# Altium schematic sheet assemblies.SchDoc
size A4; DocumentNumber: 2; SheetNumber: 2; SheetTotal: 7
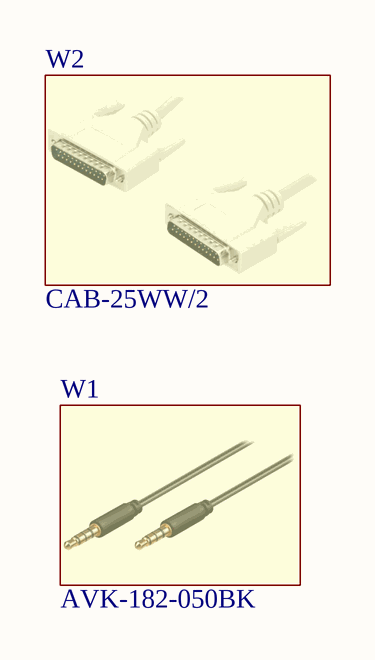
[diagram p0: assemblies.SchDoc]

## Parts
W1  AVK-182-050BK  (mechanical)
W2  CAB-25WW/2  (mechanical)

## Notes on the sheet
- Title
- Size:
- Date:
- A4
- Number:
- Time:
- Revision:
- Sheet
- of
- Fermium LABS srl
- Via Monselice 15a
- 35142 Padova PD
- Italy
- File: